# Altium project cy68013.PrjPcb
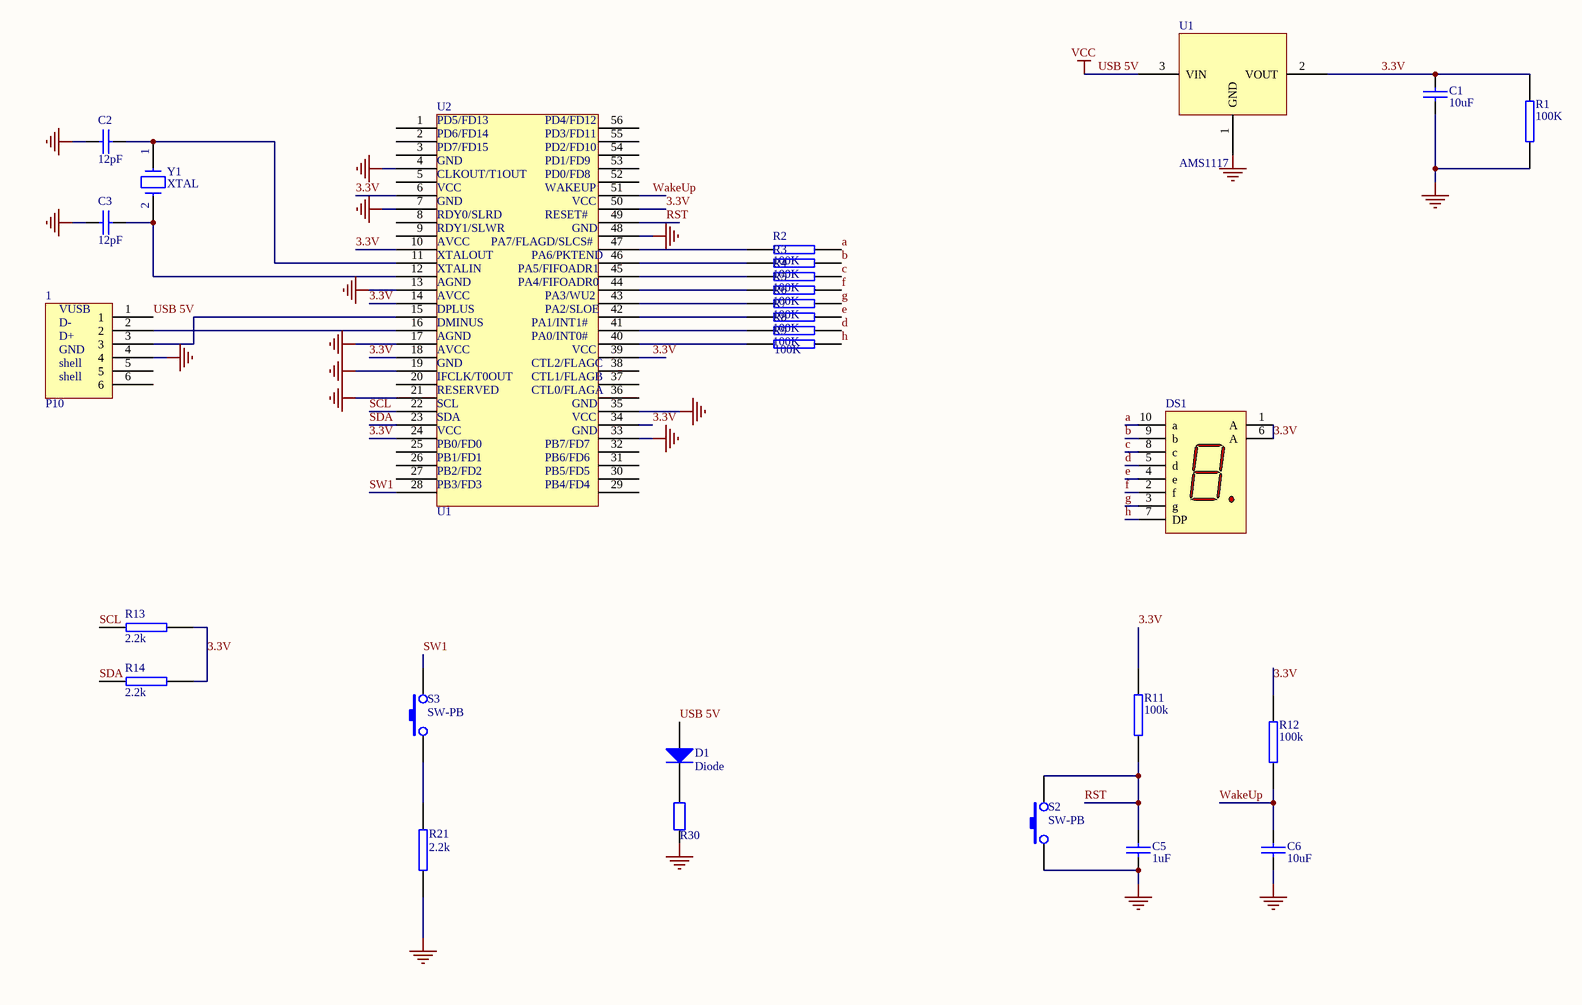
[diagram p0: Sheet1.SchDoc]
1 sheet, 28 parts. Net scope: global (net labels, ports and power ports of the same name join across sheets).
Board file: PCB1.PcbDoc

## Sheet Sheet1.SchDoc
size B; SheetNumber: 0; SheetTotal: 0

### Parts
1  P10  [787616]
C1  10uF  [0805]
C2  12pF  [0805]
C3  12pF  [0805]
C5  1uF  [0805]
C6  10uF  [0805]
D1  Diode  [0805]
DS1  Dpy Red-CA  [LEDDIP-10]  (value not drawn)
R1  100K  [0805]
R2  100K  [0805]
R3  100K  [0805]
R4  100K  [0805]
R5  100K  [0805]
R6  100K  [0805]
R7  100K  [0805]
R8  100K  [0805]
R9  100K  [0805]
R11  100k  [0805]
R12  100k  [0805]
R13  2.2k  [0805]
R14  2.2k  [0805]
R21  2.2k  [0805]
R30  Res2  [0805]  (value not drawn)
S2  SW-PB  [SW2]
S3  SW-PB  [SW2]
U1  AMS1117  [SOT223]
U2  U1  [SOP56 -1]
Y1  XTAL  [RAD-0.2]

### Nets
GND: 1.4 C1.1 C2.1 C3.1 C5.1 C6.1 R1.1 R21.1 R30.2 S2.1 U1.1(GND) U2.4 U2.7 U2.13 U2.17 U2.19 U2.21 U2.33 U2.35 U2.48
USB 5V: 1.1 D1.1(A) U1.3(VIN)  [also labelled VCC]
3.3V: C1.2 DS1.1(A) DS1.6(A) R1.2 R11.2 R12.2 R13.2 R14.2 U1.2(VOUT) U2.6 U2.10 U2.14 U2.18 U2.24 U2.34 U2.39 U2.50
a: DS1.10(a) R2.1
b: DS1.9(b) R3.1
c: DS1.8(c) R4.1
d: DS1.5(d) R8.1
e: DS1.4(e) R7.1
f: DS1.2(f) R5.1
g: DS1.3(g) R6.1
h: DS1.7(DP) R9.1
RST: C5.2 R11.1 S2.2 U2.49
SCL: R13.1 U2.22
SDA: R14.1 U2.23
SW1: S3.2 U2.28
WakeUp: C6.2 R12.1 U2.51
Net1_2: 1.2 U2.16
Net1_3: 1.3 U2.15
NetC2_2: C2.2 U2.11 Y1.1
NetC3_2: C3.2 U2.12 Y1.2
NetD1_2: D1.2(K) R30.1
NetR2_2: R2.2 U2.47
NetR3_2: R3.2 U2.46
NetR4_2: R4.2 U2.45
NetR5_2: R5.2 U2.44
NetR6_2: R6.2 U2.43
NetR7_2: R7.2 U2.42
NetR8_2: R8.2 U2.41
NetR9_2: R9.2 U2.40
NetR21_2: R21.2 S3.1

Not connected (* = marked no-connect by the designer): 1 5 6; U2 1 2 3 5 8 9 20 25 26 27 29 30 31 32 36 37 38 52 53 54 55 56

### Notes on the sheet
- (near Y1) 1
- (near Y1) 2
- (in symbol COMPONENT_1) VUSB; D-; D+; GND; shell
- (in symbol Component_1) PD5/FD13; PD4/FD12; PD6/FD14; PD3/FD11; PD7/FD15; PD2/FD10; GND; PD1/FD9; CLKOUT/T1OUT; PD0/FD8; VCC; WAKEUP; RDY0/SLRD; RESET#; RDY1/SLWR; AVCC; PA7/FLAGD/SLCS#; XTALOUT; PA6/PKTEND; XTALIN; PA5/FIFOADR1; AGND; PA4/FIFOADR0; PA3/WU2; DPLUS; PA2/SLOE; DMINUS; PA1/INT1#; PA0/INT0#; CTL2/FLAGC; IFCLK/T0OUT; CTL1/FLAGB; RESERVED; CTL0/FLAGA; SCL; SDA; PB0/FD0; PB7/FD7; PB1/FD1; PB6/FD6; PB2/FD2; PB5/FD5; PB3/FD3; PB4/FD4

### Library data of the parts
1 = COMPONENT_1
C1-C3 C5 C6 = CAP: Capacitor
D1 = Diode: Default Diode; Published: 8-Jun-2000; LatestRevisionDate: 17-Jul-2002; LatestRevisionNote: Re-released for DXP Platform.; PackageDocument: Sep-1996; PackageReference: SMC; Publisher: Altium Limited; Code_JEDEC: DO-214-AB
DS1 = Dpy Red-CA: 7.62 mm Black Surface HER 7-Segment Display: CA, RH DP; MinimumIntensity: 360 ucd; Note: IF = 5 mA; Colour: High Efficiency Red (HER); Note: Pins 1 and 6 are redundant Anodes.; Published: 8-Jun-2000; LatestRevisionDate: 17-Dec-2003; LatestRevisionNote: Schematic revised, PCB Footprint replaced.; DatasheetDocument: 19-Feb-2002; PackageDocument: 19-Feb-2002; PackageReference: LEDDIP-10; Publisher: Altium Limited; ComponentLink1Description: Manufacturer Link; ComponentLink1URL: http://www.agilent.com/
R1-R9 R11-R14 R21 = RES2
R30 = Res2: Resistor; Value: 1K; Published: 8-Jun-2000; LatestRevisionDate: 17-Jul-2002; LatestRevisionNote: Re-released for DXP Platform.; PackageReference: AXIAL-0.4; Publisher: Altium Limited
U1 = COMPONENT_2
U2 = Component_1
Y1 = CRYSTAL